# EAGLE design 8 valve (EAGLE 9.2.2)
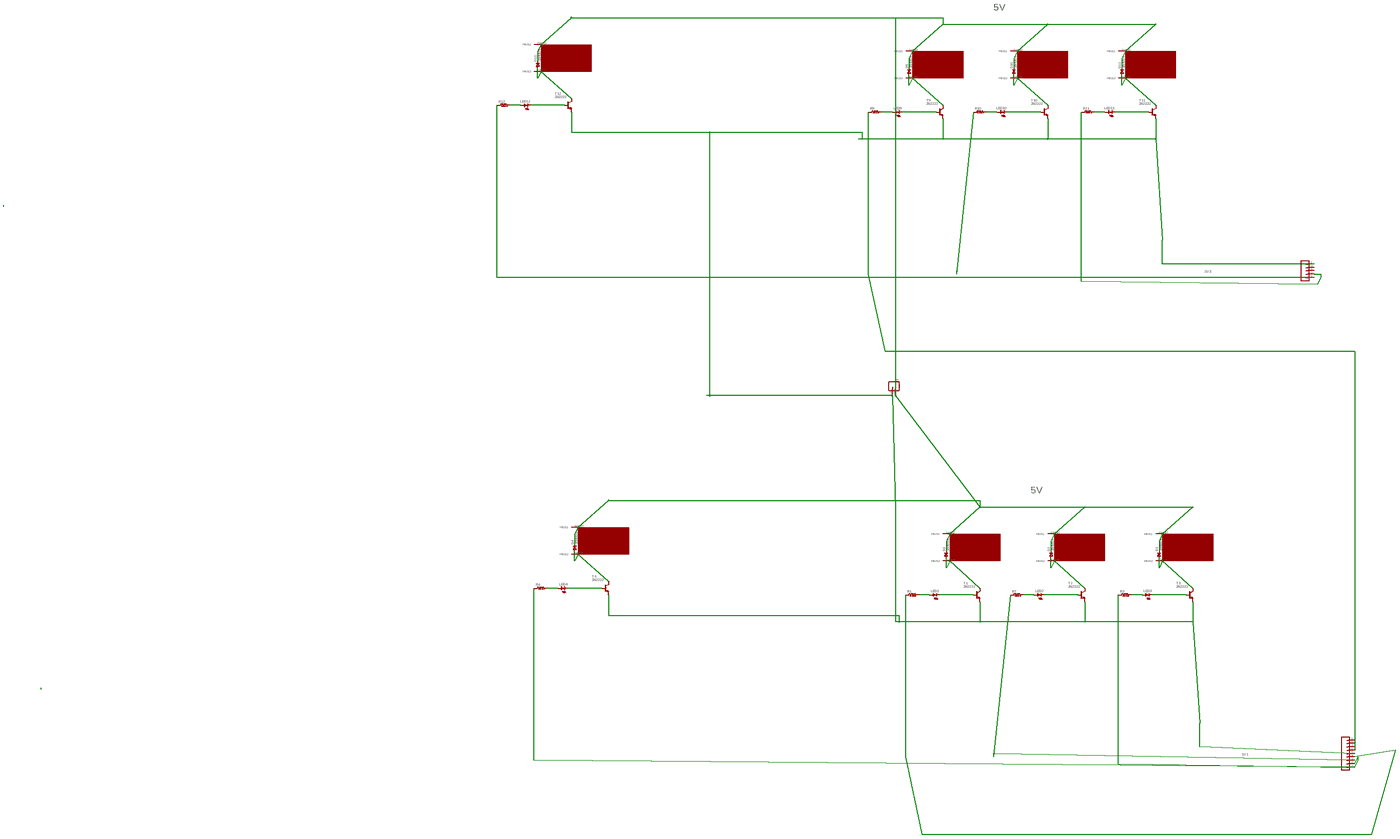
[diagram p0: schematic, sheet 1, overview]
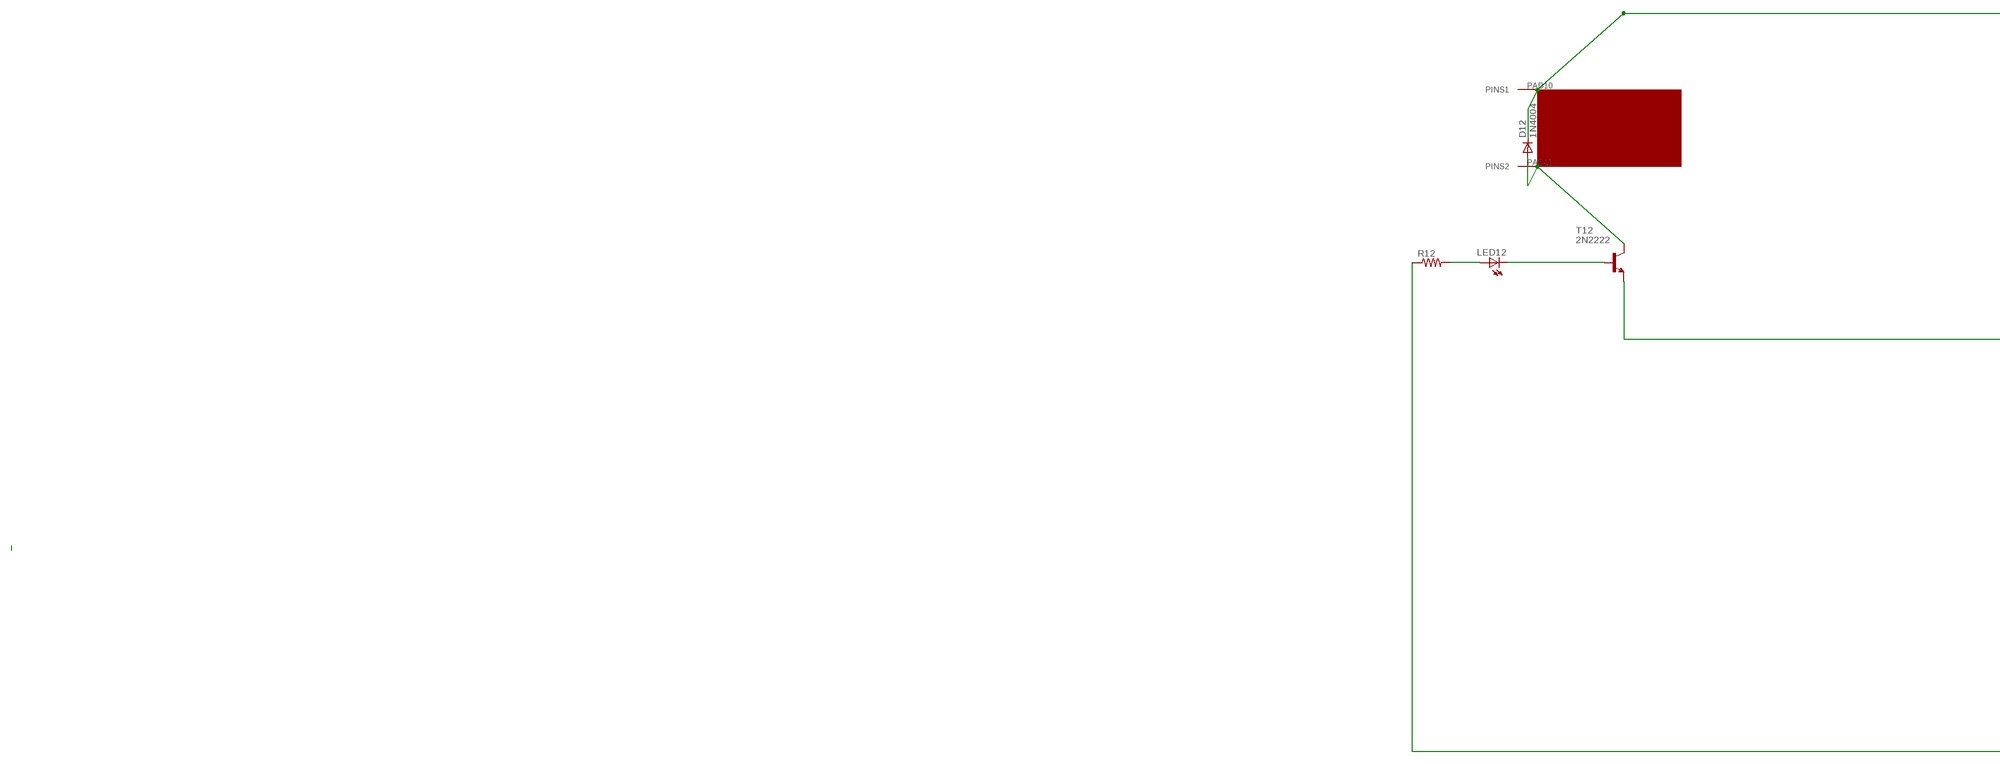
[diagram p1: schematic, sheet 1, part 1 of 4]
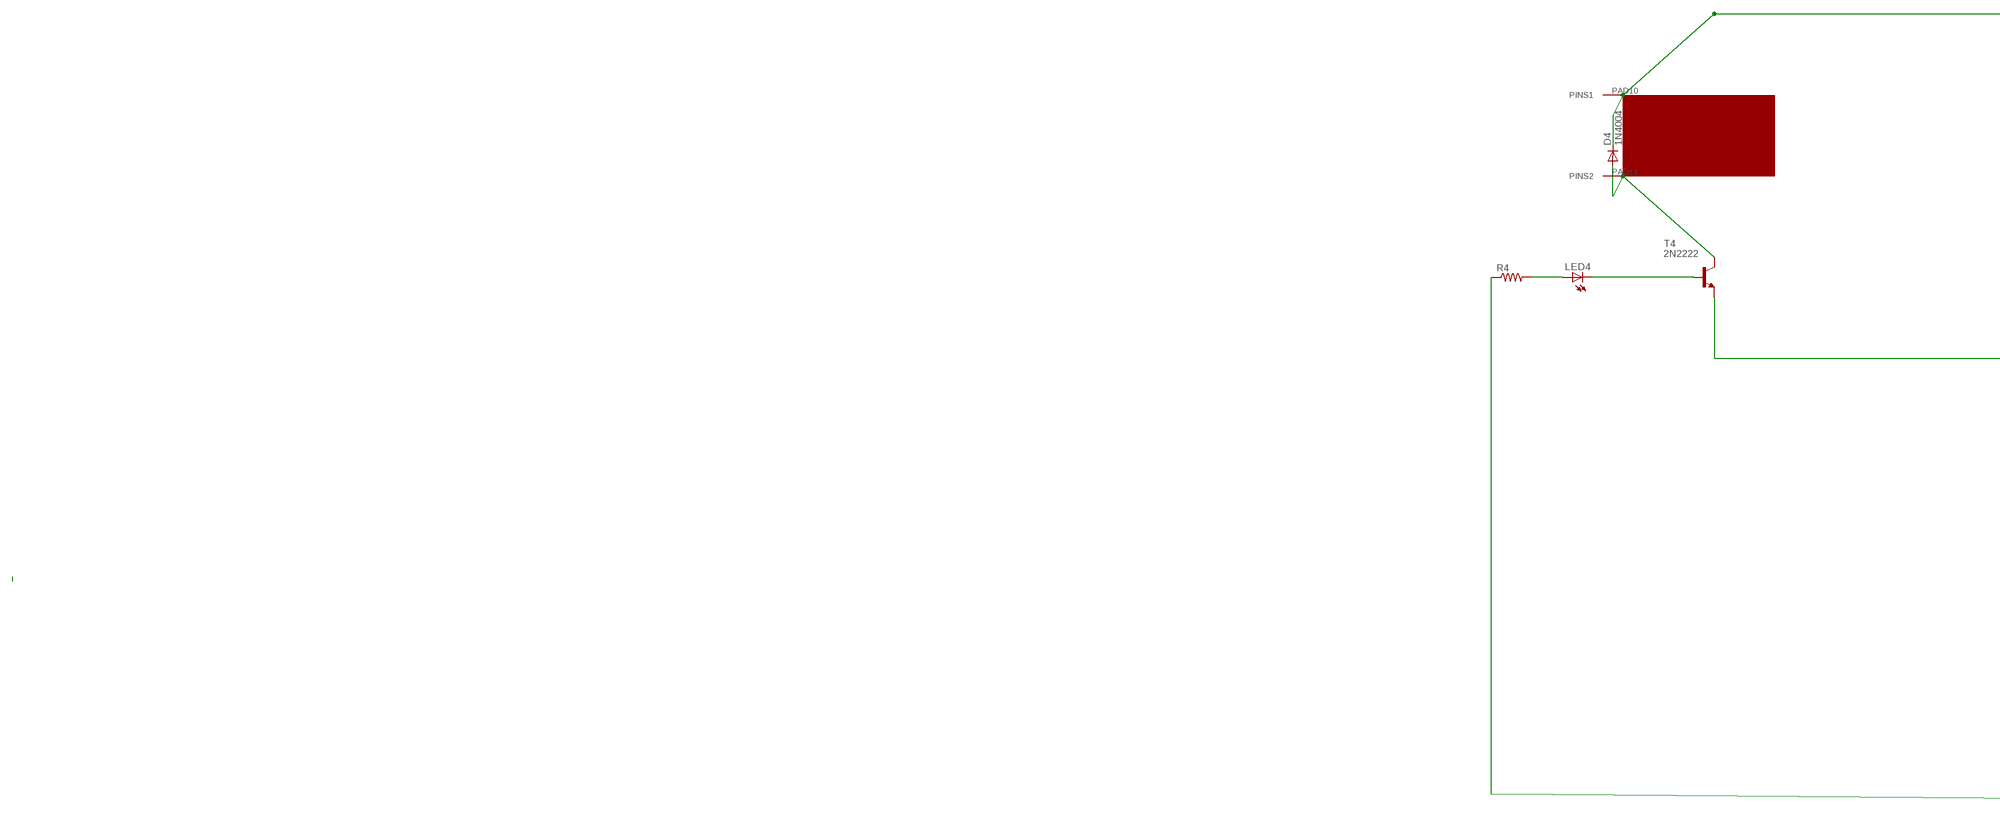
[diagram p2: schematic, sheet 1, part 2 of 4]
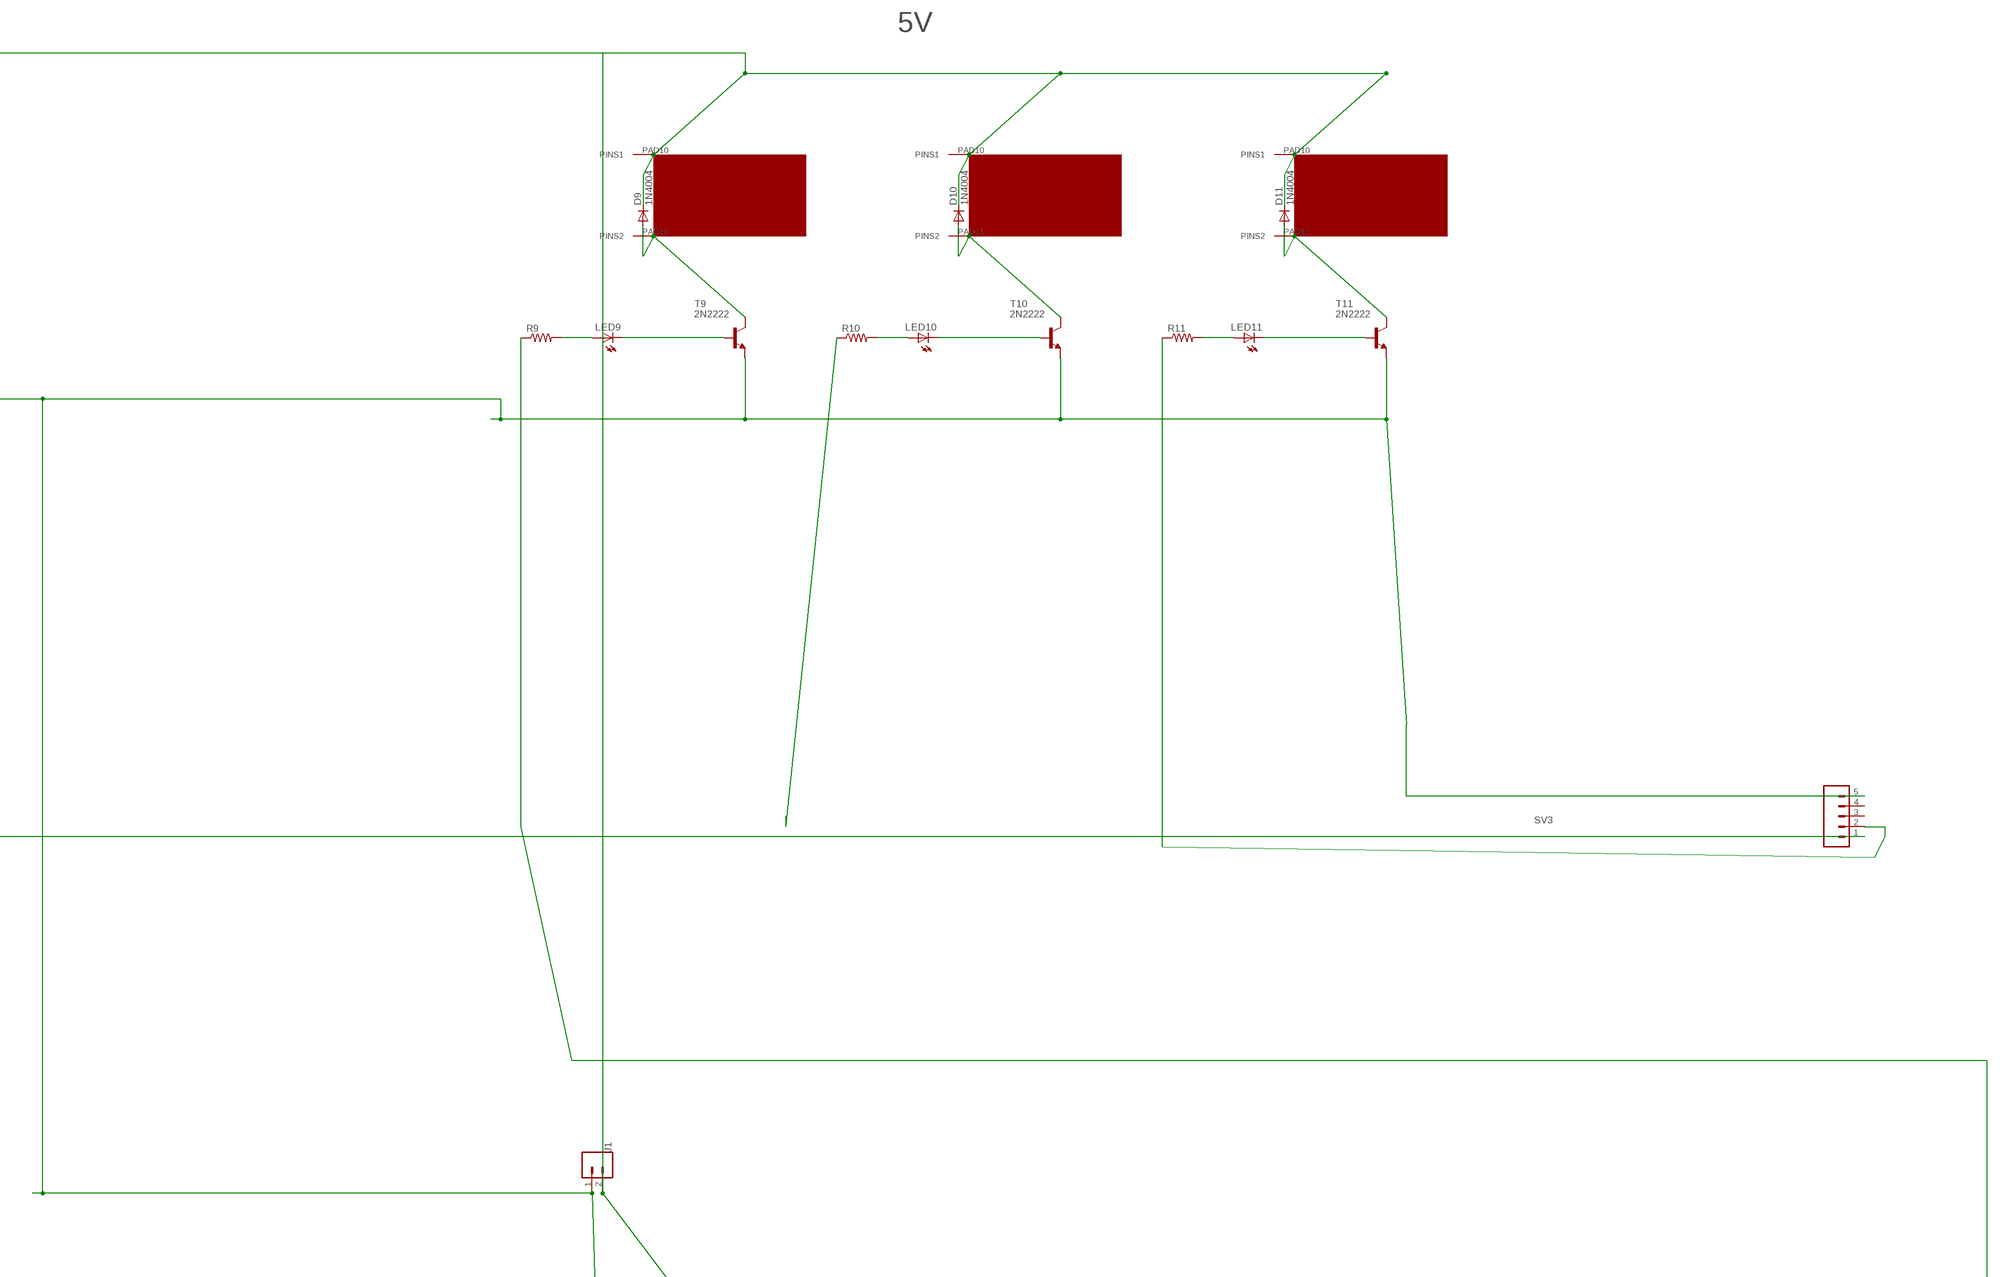
[diagram p3: schematic, sheet 1, part 3 of 4]
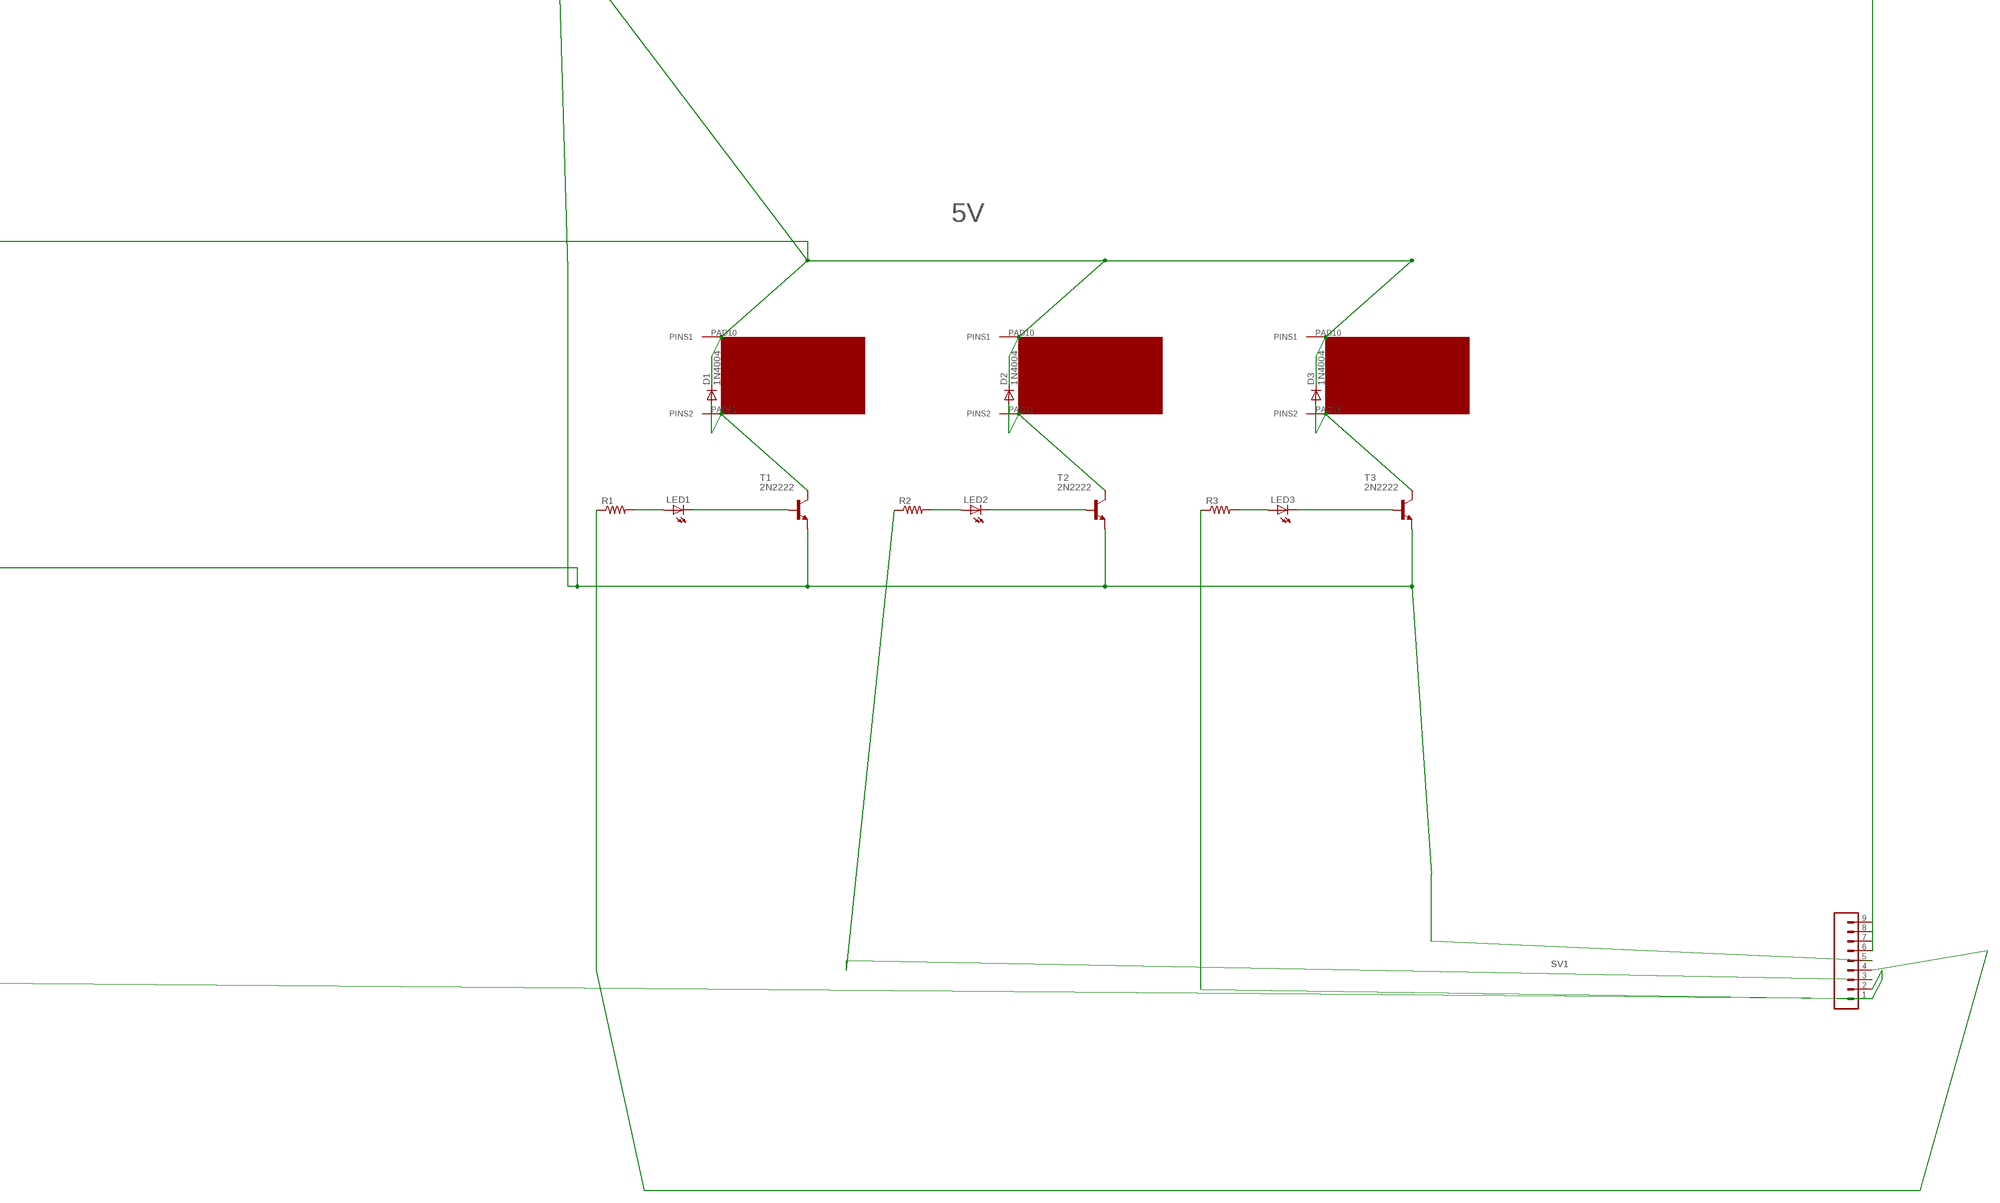
[diagram p4: schematic, sheet 1, part 4 of 4]

## Parts
D1  1N4004  [DO41-10]
D2  1N4004  [DO41-10]
D3  1N4004  [DO41-10]
D4  1N4004  [DO41-10]
D9  1N4004  [DO41-10]
D10  1N4004  [DO41-10]
D11  1N4004  [DO41-10]
D12  1N4004  [DO41-10]
J1  CONN_023.5MM  [SCREWTERMINAL-3.5MM-2]
LED1  LED5MM  [LED5MM]
LED2  LED5MM  [LED5MM]
LED3  LED5MM  [LED5MM]
LED4  LED5MM  [LED5MM]
LED9  LED5MM  [LED5MM]
LED10  LED5MM  [LED5MM]
LED11  LED5MM  [LED5MM]
LED12  LED5MM  [LED5MM]
R1  R-US_0207/10  [0207/10]
R2  R-US_0207/10  [0207/10]
R3  R-US_0207/10  [0207/10]
R4  R-US_0207/10  [0207/10]
R9  R-US_0207/10  [0207/10]
R10  R-US_0207/10  [0207/10]
R11  R-US_0207/10  [0207/10]
R12  R-US_0207/10  [0207/10]
SV1  CONN_09  [1X09]
SV3  CONN_05  [1X05]
T1  2N2222  [TO92-EBC-OVAL]
T2  2N2222  [TO92-EBC-OVAL]
T3  2N2222  [TO92-EBC-OVAL]
T4  2N2222  [TO92-EBC-OVAL]
T9  2N2222  [TO92-EBC-OVAL]
T10  2N2222  [TO92-EBC-OVAL]
T11  2N2222  [TO92-EBC-OVAL]
T12  2N2222  [TO92-EBC-OVAL]
U$1  VALVE  [VALVTEST2]
U$2  VALVE  [VALVTEST2]
U$3  VALVE  [VALVTEST2]
U$7  VALVE  [VALVTEST2]
U$8  VALVE  [VALVTEST2]
U$9  VALVE  [VALVTEST2]
VALVE2  VALVE  [VALVTEST2]
VALVE3  VALVE  [VALVTEST2]

## Nets
5V: D1.C D2.C D3.C D4.C D9.C D10.C D11.C D12.C J1.2 U$1.PAD10(PINS1) U$2.PAD10(PINS1) U$3.PAD10(PINS1) U$7.PAD10(PINS1) U$8.PAD10(PINS1) U$9.PAD10(PINS1) VALVE2.PAD10(PINS1) VALVE3.PAD10(PINS1)
GND: J1.1 SV1.5 SV3.5 T1.E T2.E T3.E T4.E T9.E T10.E T11.E T12.E
N$1: D1.A T1.C U$1.PAD11(PINS2)
N$2: LED1.K(C) T1.B
N$3: LED1.A R1.2
N$4: D4.A T4.C U$3.PAD11(PINS2)
N$5: D2.A T2.C U$2.PAD11(PINS2)
N$6: LED2.K(C) T2.B
N$7: LED2.A R2.2
N$8: LED4.K(C) T4.B
N$9: D3.A T3.C VALVE3.PAD11(PINS2)
N$10: LED3.K(C) T3.B
N$11: LED3.A R3.2
N$12: LED4.A R4.2
N$13: R4.1 SV1.1
N$14: R2.1 SV1.3
N$15: R12.1 SV3.1
N$19: R3.1 SV1.2
N$23: R9.1 SV1.6
N$30: R1.1 SV1.4
N$37: D9.A T9.C U$7.PAD11(PINS2)
N$38: LED9.K(C) T9.B
N$39: LED9.A R9.2
N$41: D10.A T10.C U$8.PAD11(PINS2)
N$43: LED10.K(C) T10.B
N$44: LED10.A R10.2
N$45: D11.A T11.C VALVE2.PAD11(PINS2)
N$46: LED11.K(C) T11.B
N$47: LED11.A R11.2
N$49: R11.1 SV3.2
N$53: D12.A T12.C U$9.PAD11(PINS2)
N$54: LED12.K(C) T12.B
N$55: LED12.A R12.2
N$57: R10.1
Unconnected: SV1.7 SV1.8 SV1.9 SV3.3 SV3.4

## Library data of the parts
D1-D4 D9-D12 = adafruit:1N4004: DIODE General purpose 1N400x type rectifier (With bigger pads) http://www.ladyada.net/library/pcb/eaglelibrary.html
J1 = SparkFun-Connectors:CONN_02: Multi connection point. Often used as Generic Header-pin footprint for 0.1 inch spaced/style header connections On any of the 0.1 inch spaced packages, you can populate with these: Break Away Headers - Straight <https://www.sparkfun.com/products/116> (PRT-00116) Break Away Male Headers - Right Angle <https://www.sparkfun.com/products/553> (PRT-00553) Female Headers <https://www.sparkfun.com/products/115> (PRT-00115) Break Away Headers - Machine Pin <https://www.sparkfun.com/products/117> (PRT-00117) Break Away Female Headers - Swiss Machine Pin <https://www.sparkfun.com/products/743> (PRT-00743) For SCREWTERMINALS and SPRING TERMINALS visit here: Screw Terimnals on SparkFun.com <https://www.sparkfun.com/search/results?term=Screw+Terminals> (5mm/3.5mm/2.54mm spacing) This device is also useful as a general connection point to wire up your design to another part of your project. Our various solder wires solder well into these plated through hole pads. Hook-Up Wire - Assortment (Stranded, 22 AWG) <https://www.sparkfun.com/products/11375> (PRT-11375) Hook-Up Wire - Assortment (Solid Core, 22 AWG) <https://www.sparkfun.com/products/11367> (PRT-11367) View the entire wire category on our website here <https://www.sparkfun.com/categories/141> Special notes: Molex polarized connector foot print use with: PRT-08233 with associated crimp pins and housings. 2.54_SCREWTERM for use with PRT-10571. 3.5mm Screw Terminal footprints for PRT-08084 5mm Screw Terminal footprints for use with PRT-08432; PROD_ID: CONN-08399
LED1-LED4 LED9-LED12 = adafruit:LED: LED OSRAM: - CHIPLED LG R971, LG N971, LY N971, LG Q971, LY Q971, LO R971, LY R971 LH N974, LH R974 LS Q976, LO Q976, LY Q976 LO Q996 - Hyper CHIPLED LW Q18S LB Q993, LB Q99A, LB R99A - SideLED LS A670, LO A670, LY A670, LG A670, LP A670 LB A673, LV A673, LT A673, LW A673 LH A674 LY A675 LS A676, LA A676, LO A676, LY A676, LW A676 LS A679, LY A679, LG A679 - Hyper Micro SIDELED® LS Y876, LA Y876, LO Y876, LY Y876 LT Y87S - SmartLED LW L88C, LW L88S LB L89C, LB L89S, LG L890 LS L89K, LO L89K, LY L89K LS L896, LA L896, LO L896, LY L896 - TOPLED LS T670, LO T670, LY T670, LG T670, LP T670 LSG T670, LSP T670, LSY T670, LOP T670, LYG T670 LG T671, LOG T671, LSG T671 LB T673, LV T673, LT T673, LW T673 LH T674 LS T676, LA T676, LO T676, LY T676, LB T676, LH T676, LSB T676, LW T676 LB T67C, LV T67C, LT T67C, LS T67K, LO T67K, LY T67K, LW E67C LS E67B, LA E67B, LO E67B, LY E67B, LB E67C, LV E67C, LT E67C LW T67C LS T679, LY T679, LG T679 LS T770, LO T770, LY T770, LG T770, LP T770 LB T773, LV T773, LT T773, LW T773 LH T774 LS E675, LA E675, LY E675, LS T675 LS T776, LA T776, LO T776, LY T776, LB T776 LHGB T686 LT T68C, LB T68C - Hyper Mini TOPLED® LB M676 - Mini TOPLED Santana® LG M470 LS M47K, LO M47K, LY M47K Source: http://www.osram.convergy.de/
R1-R4 R9-R12 = adafruit:R-US_: RESISTOR, American symbol
SV1 = SparkFun-Connectors:CONN_09: Multi connection point. Often used as Generic Header-pin footprint for 0.1 inch spaced/style header connections On any of the 0.1 inch spaced packages, you can populate with these: Break Away Headers - Straight <https://www.sparkfun.com/products/116> (PRT-00116) Break Away Male Headers - Right Angle <https://www.sparkfun.com/products/553> (PRT-00553) Female Headers <https://www.sparkfun.com/products/115> (PRT-00115) Break Away Headers - Machine Pin <https://www.sparkfun.com/products/117> (PRT-00117) Break Away Female Headers - Swiss Machine Pin <https://www.sparkfun.com/products/743> (PRT-00743) For SCREWTERMINALS and SPRING TERMINALS visit here: Screw Terimnals on SparkFun.com <https://www.sparkfun.com/search/results?term=Screw+Terminals> (5mm/3.5mm/2.54mm spacing) This device is also useful as a general connection point to wire up your design to another part of your project. Our various solder wires solder well into these plated through hole pads. Hook-Up Wire - Assortment (Stranded, 22 AWG) <https://www.sparkfun.com/products/11375> (PRT-11375) Hook-Up Wire - Assortment (Solid Core, 22 AWG) <https://www.sparkfun.com/products/11367> (PRT-11367) View the entire wire category on our website here <https://www.sparkfun.com/categories/141> Special notes: Molex polarized connector foot print use with SKU : PRT-08231 with associated crimp pins and housings. 1MM SMD Version SKU: PRT-10208 NOTES ON THE VARIANTS LOCK and LOCK_LONGPADS... This footprint was designed to help hold the alignment of a through-hole component (i.e. 6-pin header) while soldering it into place. You may notice that each hole has been shifted either up or down by 0.005 of an inch from it's more standard position (which is a perfectly straight line). This slight alteration caused the pins (the squares in the middle) to touch the edges of the holes. Because they are alternating, it causes a "brace" to hold the component in place. 0.005 has proven to be the perfect amount of "off-center" position when using our standard breakaway headers. Although looks a little odd when you look at the bare footprint, once you have a header in there, the alteration is very hard to notice. Also,if you push a header all the way into place, it is covered up entirely on the bottom side.
SV3 = SparkFun-Connectors:CONN_05: Multi connection point. Often used as Generic Header-pin footprint for 0.1 inch spaced/style header connections On any of the 0.1 inch spaced packages, you can populate with these: Break Away Headers - Straight <https://www.sparkfun.com/products/116> (PRT-00116) Break Away Male Headers - Right Angle <https://www.sparkfun.com/products/553> (PRT-00553) Female Headers <https://www.sparkfun.com/products/115> (PRT-00115) Break Away Headers - Machine Pin <https://www.sparkfun.com/products/117> (PRT-00117) Break Away Female Headers - Swiss Machine Pin <https://www.sparkfun.com/products/743> (PRT-00743) For SCREWTERMINALS and SPRING TERMINALS visit here: Screw Terimnals on SparkFun.com <https://www.sparkfun.com/search/results?term=Screw+Terminals> (5mm/3.5mm/2.54mm spacing) This device is also useful as a general connection point to wire up your design to another part of your project. Our various solder wires solder well into these plated through hole pads. Hook-Up Wire - Assortment (Stranded, 22 AWG) <https://www.sparkfun.com/products/11375> (PRT-11375) Hook-Up Wire - Assortment (Solid Core, 22 AWG) <https://www.sparkfun.com/products/11367> (PRT-11367) View the entire wire category on our website here <https://www.sparkfun.com/categories/141> Special notes: Molex polarized connector foot print use with SKU : PRT-08231 with associated crimp pins and housings. 1MM SMD Version SKU: PRT-10208
T1-T4 T9-T12 = adafruit:2N2222: NPN TRANSISTOR Big oval pads
U$1-U$3 U$7-U$9 VALVE2 VALVE3 = local eagle library:VALVE: pn eumatic valve

## Board
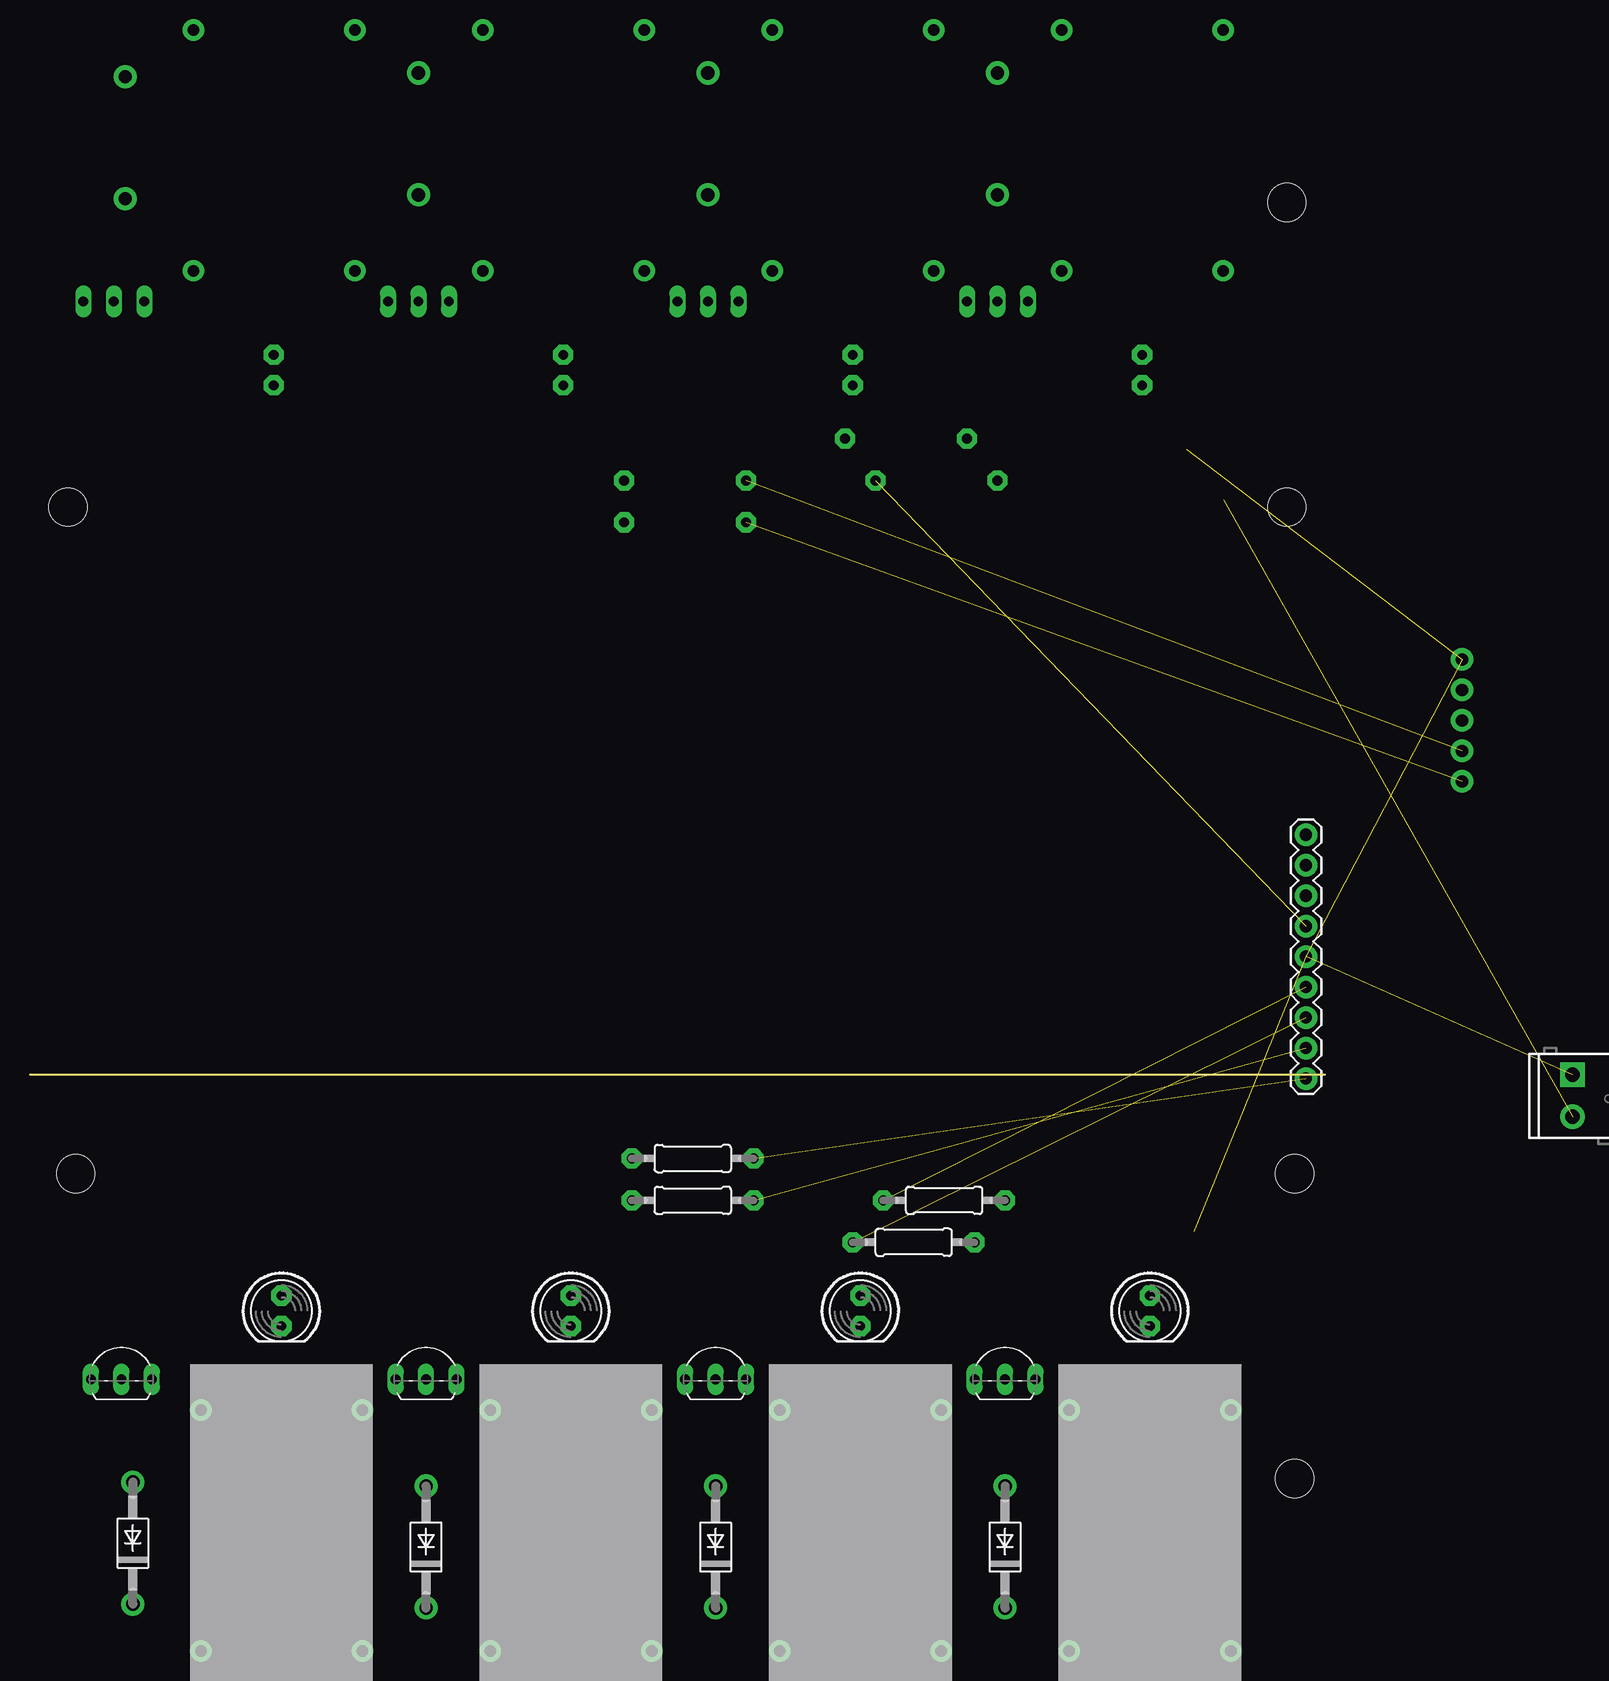
[diagram p5: board, top side]
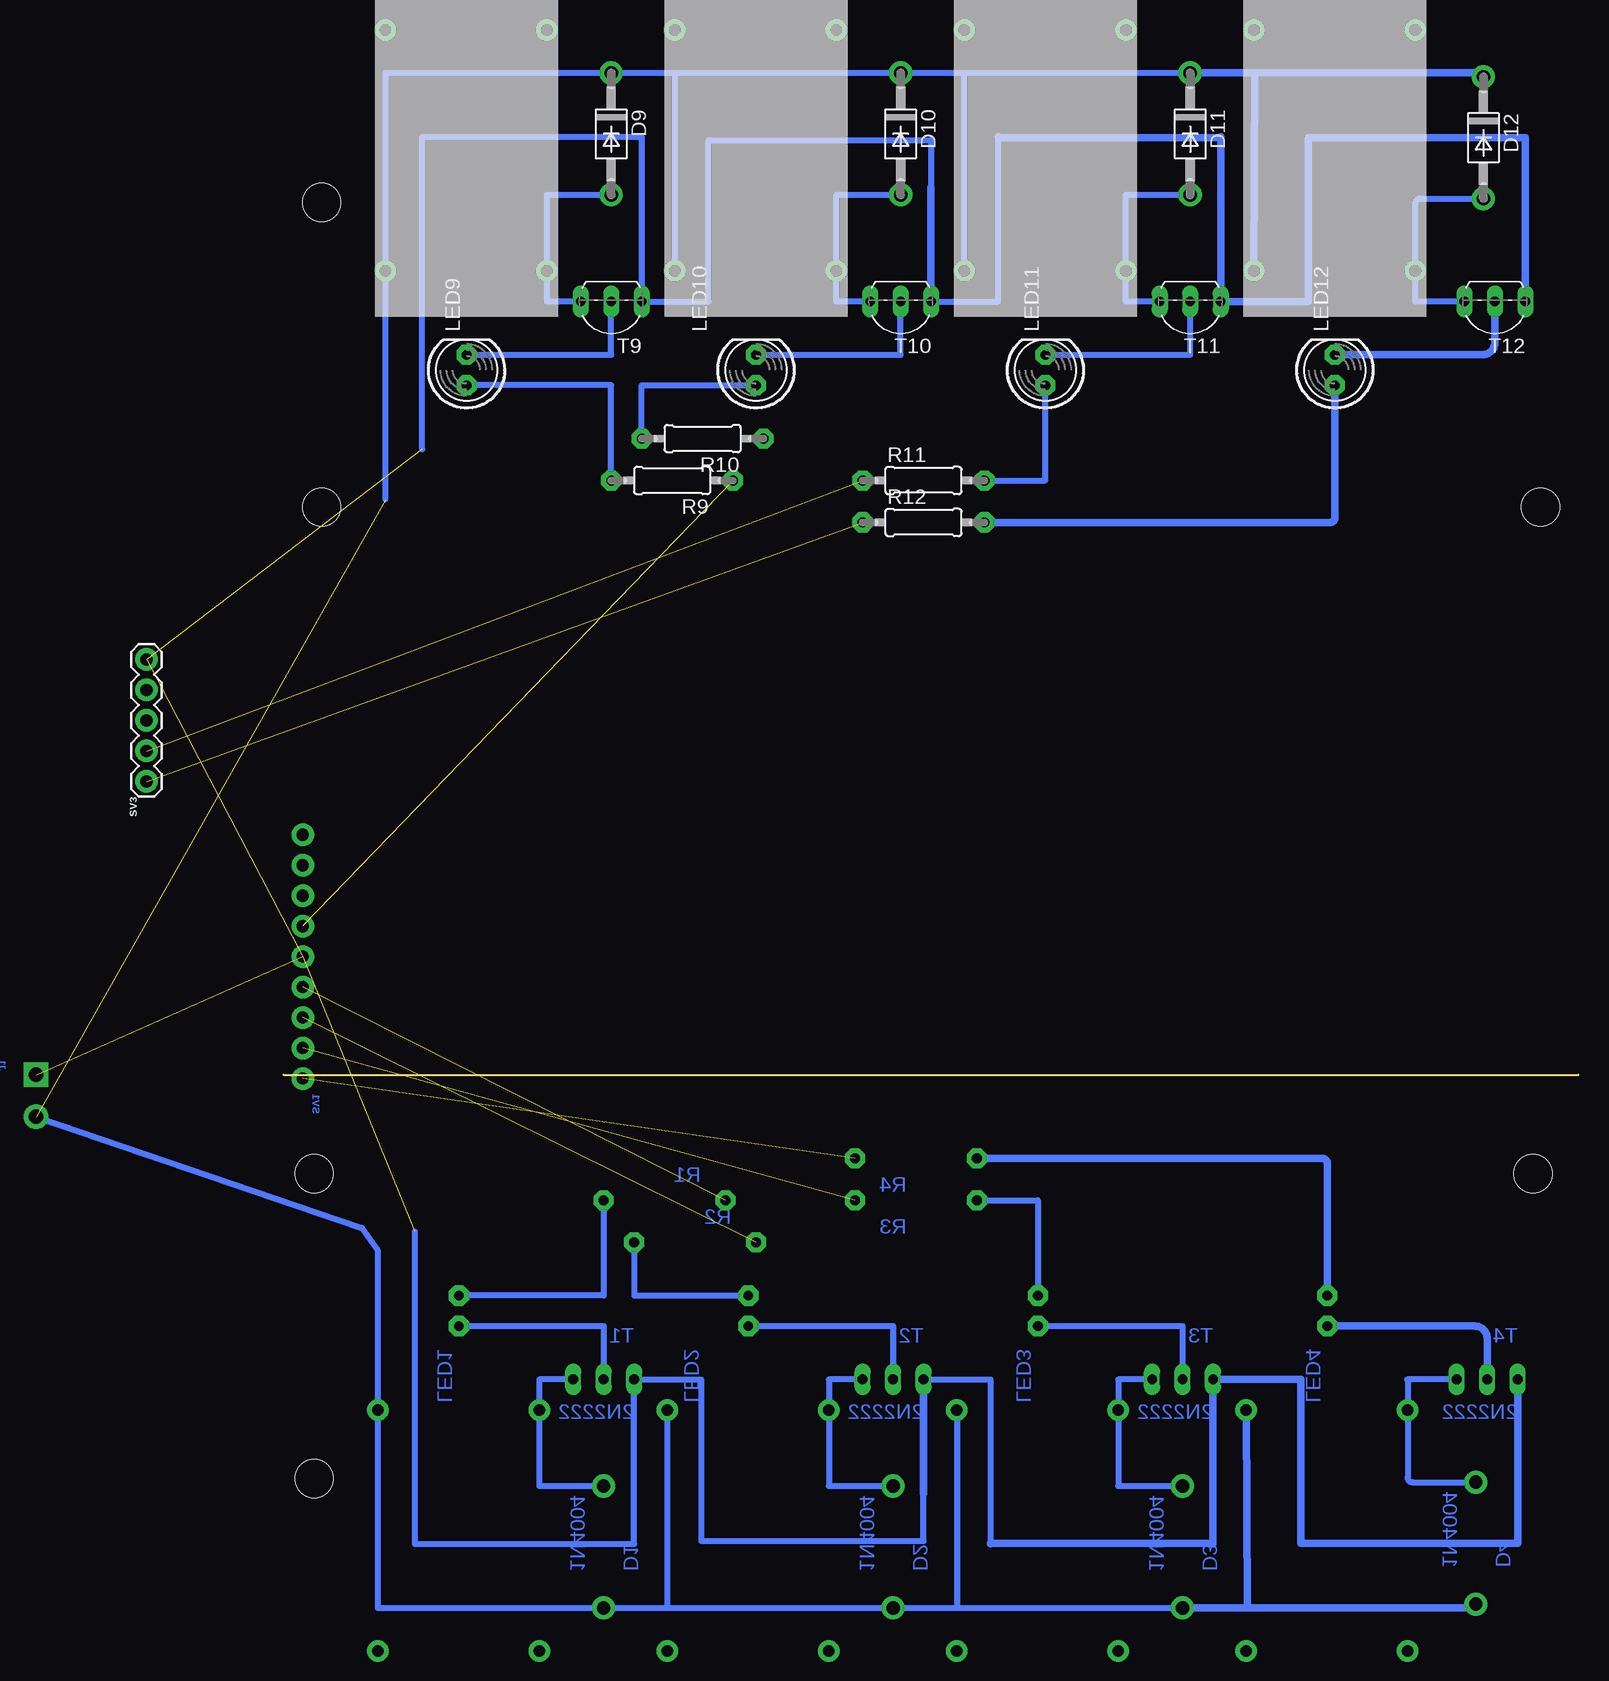
[diagram p6: board, bottom side, seen from below]

Size 107.95 x 0 mm. Coordinates in mm from the lower left corner, seen from the top.
Outline: 107.95,0 0,0
Copper layers (1*16): Top 0.035mm / dielectric 1.5mm / Bottom 0.035mm
Design rules "default": minimum track width 6mil, minimum drill 0.35mm, track to track 6mil, track to pad 6mil, pad to pad 6mil, via to via 6mil, smd to smd 6mil, copper to edge 40mil, drill to drill 6mil, minimum pad ring 10mil, minimum via ring 8mil, stop-mask expansion 4mil, vias tented up to drill 0mil, thermal gap 10mil
Holes 3.17 mm at 105.41,-8.25 105.41,-33.65 3.81,-8.25 104.77,47.31 104.77,72.71 3.17,47.31

### Footprints (pad centres in the part's own frame; a part is rotated, then mirrored left to right if it is on the bottom)
DO41-10 = drill 1.118 pad 1.93: A 5.08,0; C -5.08,0
SCREWTERMINAL-3.5MM-2 = drill 1.2 pad 2.032 square: 1 0,0 | drill 1.2 pad 2.032: 2 3.5,0
LED5MM = drill 0.813 pad 1.676 octagon: A -1.27,0; K 1.27,0
0207/10 = drill 0.813 pad 1.676 octagon: 1 -5.08,0; 2 5.08,0
1X09 = drill 1.016 pad 1.88: 1 0,0; 2 2.54,0; 3 5.08,0; 4 7.62,0; 5 10.16,0; 6 12.7,0; 7 15.24,0; 8 17.78,0; 9 20.32,0
1X05 = drill 1.016 pad 1.88: 1 0,0; 2 2.54,0; 3 5.08,0; 4 7.62,0; 5 10.16,0
TO92-EBC-OVAL = drill 0.813 long: B 0,-1.27; C 2.54,-1.27; E -2.54,-1.27
VALVTEST2 = drill 0.965 pad 1.778: PAD10 3.835,-0.864; PAD11 3.835,-14.326; PAD12 23.901,-14.326; PAD13 23.901,-0.864

### Placement (x,y rotation side)
D1  81.28,-39.37 90 top  (outside the outline)
D2  57.15,-39.37 90 top  (outside the outline)
D3  33.02,-39.37 90 top  (outside the outline)
D4  8.57,-39.05 90 top  (outside the outline)
D9  80.64,78.42 270 bottom  (outside the outline)
D10  56.51,78.42 270 bottom  (outside the outline)
D11  32.38,78.42 270 bottom  (outside the outline)
D12  7.94,78.11 270 bottom  (outside the outline)
J1  128.59,0 270 top  (outside the outline)
LED1  93.34,-19.68 270 top  (outside the outline)
LED2  69.21,-19.68 270 top  (outside the outline)
LED3  45.08,-19.68 270 top  (outside the outline)
LED4  20.95,-19.68 270 top  (outside the outline)
LED9  92.71,58.74 90 bottom  (outside the outline)
LED10  68.58,58.74 90 bottom  (outside the outline)
LED11  44.45,58.74 90 bottom  (outside the outline)
LED12  20.32,58.74 90 bottom  (outside the outline)
R1  76.2,-10.48 0 top  (outside the outline)
R2  73.66,-13.97 0 top  (outside the outline)
R3  55.24,-10.48 180 top  (outside the outline)
R4  55.24,-6.98 180 top  (outside the outline)
R9  75.56,49.53 180 bottom  (outside the outline)
R10  73.02,53.02 180 bottom  (outside the outline)
R11  54.61,49.53 0 bottom  (outside the outline)
R12  54.61,46.04 0 bottom  (outside the outline)
SV1  106.36,-0.32 90 top
SV3  119.38,24.45 90 bottom  (outside the outline)
T1  81.28,-24.13 0 top  (outside the outline)
T2  57.15,-24.13 0 top  (outside the outline)
T3  33.02,-24.13 0 top  (outside the outline)
T4  7.62,-24.13 0 top  (outside the outline)
T9  80.64,63.18 180 bottom  (outside the outline)
T10  56.51,63.18 180 bottom  (outside the outline)
T11  32.38,63.18 180 bottom  (outside the outline)
T12  6.98,63.18 180 bottom  (outside the outline)
U$1  100.96,-24.13 270 top  (outside the outline)
U$2  76.83,-24.13 270 top  (outside the outline)
U$3  28.57,-24.13 270 top  (outside the outline)
U$7  100.33,63.18 90 bottom  (outside the outline)
U$8  76.2,63.18 90 bottom  (outside the outline)
U$9  27.94,63.18 90 bottom  (outside the outline)
VALVE2  52.07,63.18 90 bottom  (outside the outline)
VALVE3  52.7,-24.13 270 top  (outside the outline)

### Tracks (layer width: path | path; a pad name or v marks a point on that pad's centre or on a via)
5V  (via drill 0.35)  (1 unrouted)
  Top 0.635: v7.94,83.5 D12.C
  Bottom 0.508: J1.2 101.46,-12.76 100.1,-14.66 U$1.PAD10 100.1,-44.45 D1.C 75.97,-44.45 | 75.97,-44.45 D2.C 51.84,-44.45 | U$2.PAD10 75.97,-44.45 | 51.84,-44.45 D3.C | VALVE3.PAD10 51.84,-44.45 | 99.47,47.94 U$7.PAD10 99.47,83.5 D9.C 75.34,83.5 | 75.34,83.5 D10.C 51.21,83.5 | U$8.PAD10 75.34,83.5 | 51.21,83.5 D11.C | VALVE2.PAD10 51.21,83.5
  Bottom 0.635: D3.C 27.62,-44.45 | 27.62,-44.45 8.57,-44.45 D4.C | U$3.PAD10 27.62,-44.45 | D11.C 26.99,83.5 | 26.99,83.5 v7.94,83.5 | U$9.PAD10 26.99,83.5
GND  (4 unrouted)
  Bottom 0.508: 97.03,-13.08 97.03,-39.12 78.74,-39.12 T1.E 73.15,-25.4 73.15,-38.86 54.61,-38.86 54.61,-34.92 | T2.E 49.02,-25.4 49.02,-39.12 | 96.39,52.13 96.39,78.17 78.1,78.17 T9.E 72.52,64.45 72.52,77.91 53.97,77.91 53.97,73.98 | T10.E 48.39,64.45 48.39,78.17 | 29.72,64.45 T11.E
  Bottom 0.635: 54.61,-34.92 T2.E | 30.48,-39.05 T3.E 23.18,-25.4 23.18,-39.05 5.08,-39.05 T4.E | 30.48,-39.05 30.48,-39.12 | 30.48,-39.05 48.96,-39.05 arc-90 49.02,-39.12 | 53.97,73.98 T10.E | 29.84,78.11 T11.E 22.54,64.45 22.54,78.11 4.44,78.11 T12.E | 29.84,78.11 29.84,78.17 | 29.84,78.11 48.32,78.11 arc90 48.39,78.17
N$1
  Bottom 0.508: T1.C 86.64,-25.4 U$1.PAD11 86.64,-34.29 D1.A
N$2
  Bottom 0.508: LED1.K 81.28,-20.95 T1.B
N$3
  Bottom 0.508: R1.2 81.28,-18.41 LED1.A
N$4
  Bottom 0.508: T4.C 14.29,-25.4 arc90 14.25,-25.44 U$3.PAD11 14.25,-33.58 arc-90 13.85,-33.97 D4.A
N$5
  Bottom 0.508: T2.C 62.51,-25.4 U$2.PAD11 62.51,-34.29 D2.A
N$6
  Bottom 0.508: LED2.K 57.15,-20.95 T2.B
N$7
  Bottom 0.508: R2.2 78.74,-18.41 LED2.A
N$8
  Bottom 0.635: LED4.K 8.65,-20.95 arc90 7.62,-21.99 T4.B
N$9
  Bottom 0.508: T3.C 38.38,-25.4 VALVE3.PAD11 38.38,-34.29 D3.A
N$10
  Bottom 0.508: LED3.K 33.02,-20.95 T3.B
N$11
  Bottom 0.508: R3.2 45.08,-10.48 LED3.A
N$12
  Bottom 0.635: R4.2 21.35,-6.98 arc90 20.95,-7.38 LED4.A
N$13  (1 unrouted)
N$14  (1 unrouted)
N$15  (1 unrouted)
N$19  (1 unrouted)
N$23  (1 unrouted)
N$30  (1 unrouted)
N$37
  Bottom 0.508: T9.C 86,64.45 U$7.PAD11 86,73.34 D9.A
N$38
  Bottom 0.508: LED9.K 80.64,60.01 T9.B
N$39
  Bottom 0.508: R9.2 80.64,57.47 LED9.A
N$41
  Bottom 0.508: T10.C 61.87,64.45 U$8.PAD11 61.87,73.34 D10.A
N$43
  Bottom 0.508: LED10.K 56.51,60.01 T10.B
N$44
  Bottom 0.508: R10.2 78.1,57.47 LED10.A
N$45
  Bottom 0.508: T11.C 37.15,64.45 37.74,64.45 VALVE2.PAD11 37.74,73.34 D11.A
N$46
  Bottom 0.508: LED11.K 32.38,60.01 T11.B
N$47
  Bottom 0.508: R11.2 44.45,49.53 LED11.A
N$49  (1 unrouted)
N$53
  Bottom 0.508: T12.C 13.65,64.45 arc-90 13.61,64.49 U$9.PAD11 13.61,72.63 arc90 13.22,73.03 D12.A
N$54
  Bottom 0.635: LED12.K 8.02,60.01 arc-90 6.98,61.04 T12.B
N$55
  Bottom 0.635: R12.2 20.72,46.04 arc-90 20.32,46.43 LED12.A